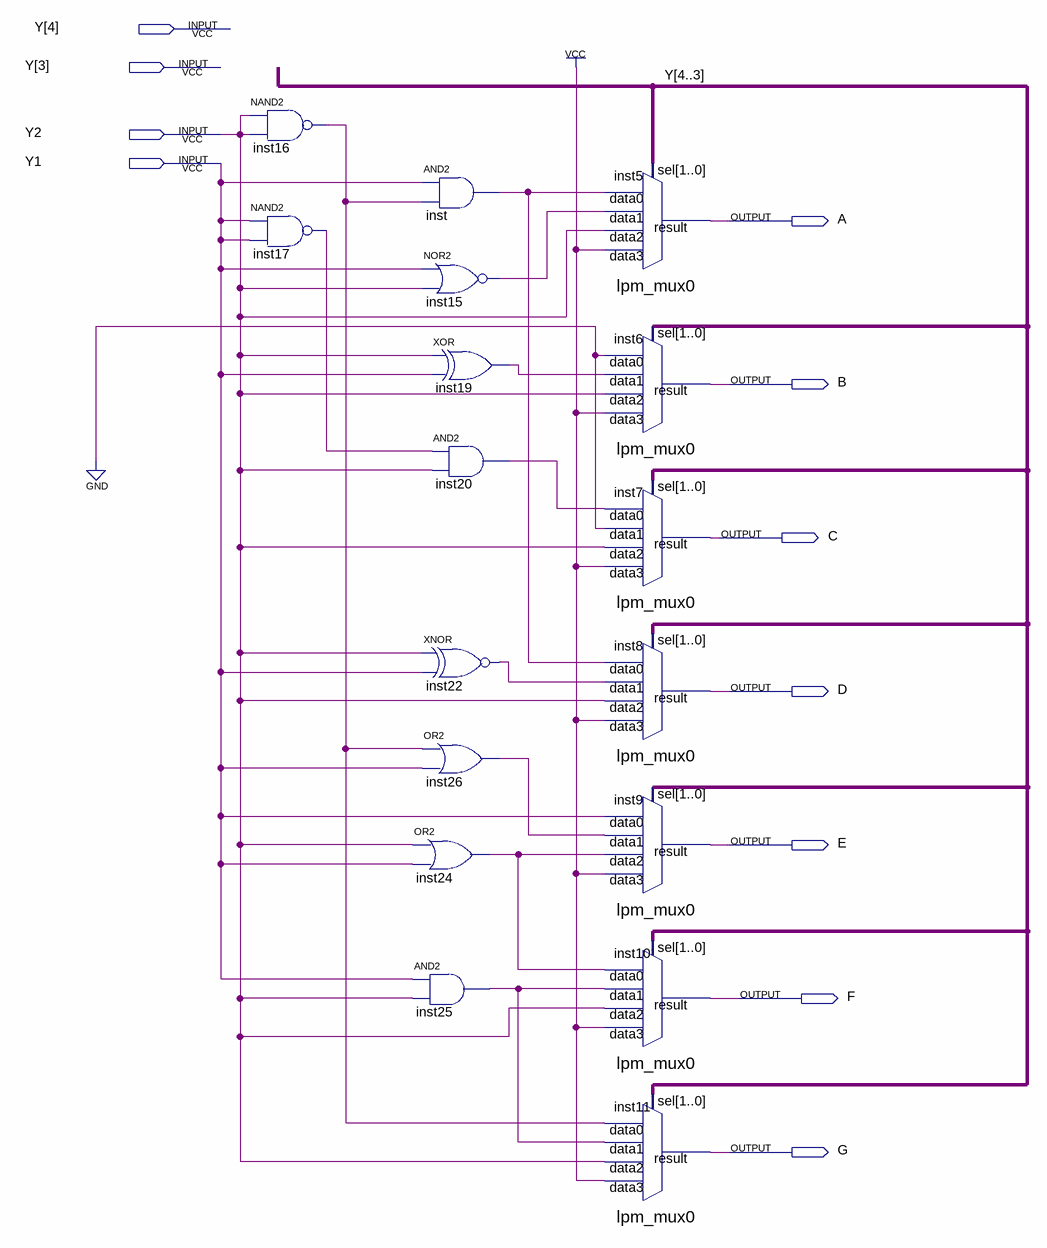
[diagram p0: schematic sheet]
// Quartus schematic design2_gudmundsson.bdf as structural Verilog: 17 symbols, 11 pins
module design2_gudmundsson (
  input  [4:3] Y,
  input  Y2,
  input  Y1,
  output A,
  output B,
  output C,
  output D,
  output E,
  output F,
  output G
);

  wire inst15_out, inst16_out, inst17_out, inst19_out, inst20_out, inst22_out, inst24_out, inst25_out,
       inst26_out, inst_out;

  nand inst16 (inst16_out, Y2, Y2);
  nand inst17 (inst17_out, Y1, Y1);
  and inst (inst_out, Y1, inst16_out);
  nor inst15 (inst15_out, Y1, Y2);
  xnor inst22 (inst22_out, Y2, Y1);
  or inst26 (inst26_out, inst16_out, Y1);
  or inst24 (inst24_out, Y2, Y1);
  and inst25 (inst25_out, Y1, Y2);
  xor inst19 (inst19_out, Y2, Y1);
  and inst20 (inst20_out, inst17_out, Y2);
  lpm_mux0 inst5 (.data3(1'b1), .data2(Y2), .data1(inst15_out), .data0(inst_out), .sel(Y), .result(A));
  lpm_mux0 inst6 (.data3(1'b1), .data2(Y2), .data1(inst19_out), .data0(1'b0), .sel(Y), .result(B));
  lpm_mux0 inst7 (.data3(1'b1), .data2(Y2), .data1(1'b0), .data0(inst20_out), .sel(Y), .result(C));
  lpm_mux0 inst8 (.data3(1'b1), .data2(Y2), .data1(inst22_out), .data0(inst_out), .sel(Y), .result(D));
  lpm_mux0 inst9 (.data3(1'b1), .data2(inst24_out), .data1(inst26_out), .data0(Y1), .sel(Y), .result(E));
  lpm_mux0 inst10 (.data3(1'b1), .data2(Y2), .data1(inst25_out), .data0(inst24_out), .sel(Y), .result(F));
  lpm_mux0 inst11 (.data3(1'b1), .data2(Y2), .data1(inst25_out), .data0(inst16_out), .sel(Y), .result(G));
endmodule
